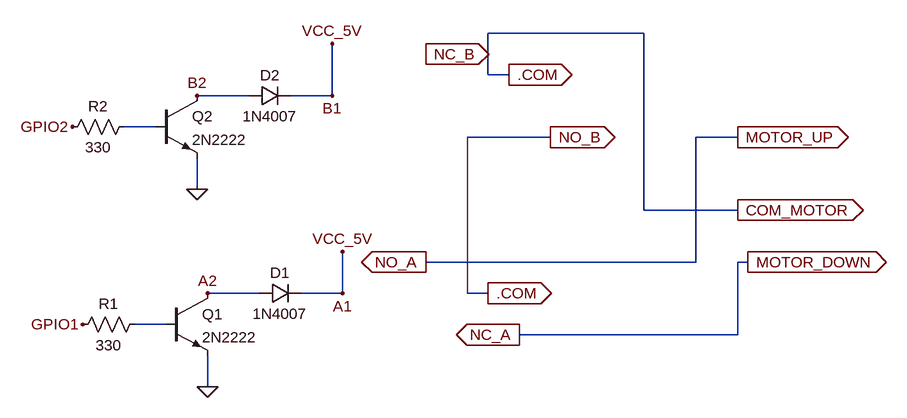
[diagram p0: schematic panjur.asc]
panjur.asc, the LTspice schematic file:
Version 4.1
SHEET 1 1196 680
WIRE 800 -304 560 -304
WIRE 560 -240 560 -304
WIRE 592 -240 560 -240
WIRE 192 -208 112 -208
WIRE 320 -208 320 -288
WIRE 320 -208 256 -208
WIRE 48 -160 0 -160
WIRE 656 -144 528 -144
WIRE 944 -144 880 -144
WIRE 112 -64 112 -112
WIRE 800 -32 800 -304
WIRE 944 -32 800 -32
WIRE 880 48 880 -144
WIRE 880 48 464 48
WIRE 960 48 944 48
WIRE 208 96 128 96
WIRE 336 96 336 32
WIRE 336 96 272 96
WIRE 528 96 528 -144
WIRE 560 96 528 96
WIRE 64 144 16 144
WIRE 944 160 944 48
WIRE 944 160 608 160
WIRE 128 240 128 192
FLAG 128 240 0
FLAG 128 96 A2
FLAG -64 144 GPIO1
FLAG 336 96 A1
FLAG 112 -64 0
FLAG 112 -208 B2
FLAG -80 -160 GPIO2
FLAG 320 -288 VCC_5V
FLAG 320 -208 B1
FLAG 464 -272 NC_B
IOPIN 464 -272 Out
FLAG 592 -240 .COM
IOPIN 592 -240 Out
FLAG 656 -144 NO_B
IOPIN 656 -144 Out
FLAG 464 48 NO_A
IOPIN 464 48 Out
FLAG 560 96 .COM
IOPIN 560 96 Out
FLAG 608 160 NC_A
IOPIN 608 160 Out
FLAG 944 -144 MOTOR_UP
IOPIN 944 -144 Out
FLAG 960 48 MOTOR_DOWN
IOPIN 960 48 Out
FLAG 944 -32 COM_MOTOR
IOPIN 944 -32 Out
FLAG 336 32 VCC_5V
SYMBOL npn 64 96 R0
SYMATTR InstName Q1
SYMATTR Value 2N2222
SYMBOL res 32 128 R90
WINDOW 0 0 56 VBottom 2
WINDOW 3 32 56 VTop 2
SYMATTR InstName R1
SYMATTR Value 330
SYMBOL diode 208 112 R270
WINDOW 0 32 32 VTop 2
WINDOW 3 0 32 VBottom 2
SYMATTR InstName D1
SYMATTR Value 1N4007
SYMBOL npn 48 -208 R0
SYMATTR InstName Q2
SYMATTR Value 2N2222
SYMBOL res 16 -176 R90
WINDOW 0 0 56 VBottom 2
WINDOW 3 32 56 VTop 2
SYMATTR InstName R2
SYMATTR Value 330
SYMBOL diode 192 -192 R270
WINDOW 0 32 32 VTop 2
WINDOW 3 0 32 VBottom 2
SYMATTR InstName D2
SYMATTR Value 1N4007

The netlist it stands for:
* panjur.asc
Q1 A2 N002 0 0 2N2222
R1 N002 GPIO1 330
D1 A2 B1 1N4007
Q2 B2 N001 0 0 2N2222
R2 N001 GPIO2 330
D2 B2 B1 1N4007
.model D D
.lib standard.dio
.model NPN NPN
.model PNP PNP
.lib standard.bjt
.backanno
.end